# Altium schematic sheet Battery_Interface.SchDoc
size A4; Organization: TESLA Motors, INC; Address1: 3500 Deer Creek Road; Address2: Palo Alto, CA; Address4: U.S.A.; SheetNumber: 2; SheetTotal: 8
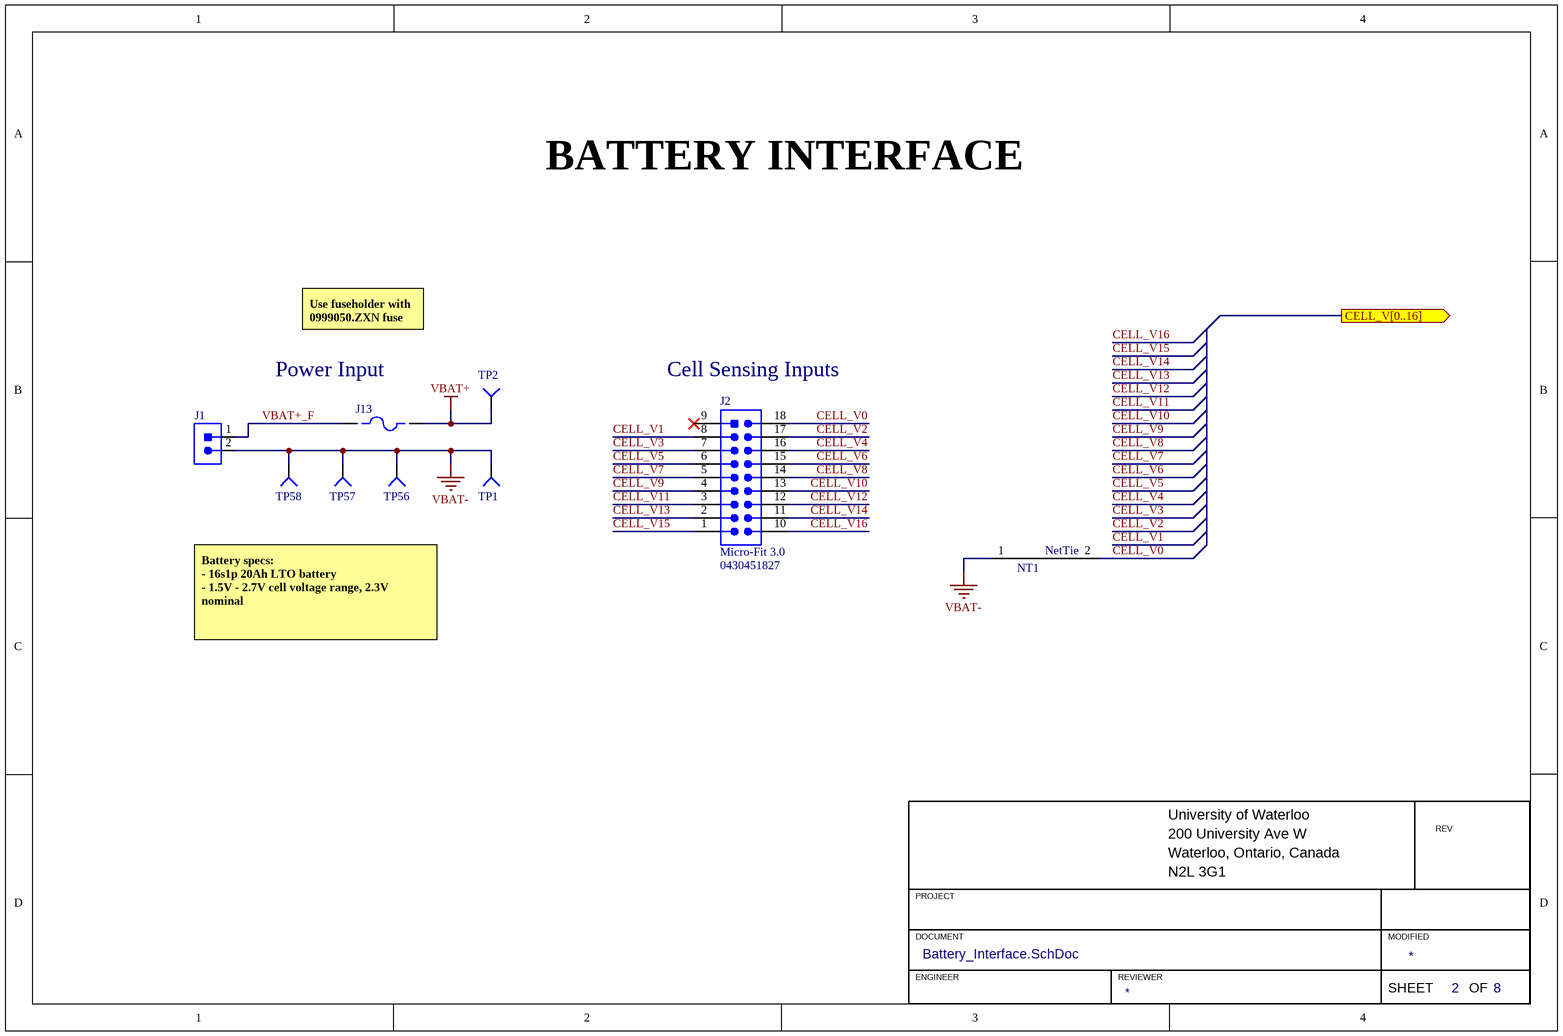
[diagram p0: Battery_Interface.SchDoc]

## Parts
J1  CON_2POS_XT90  [XT90]  (value not drawn)
J2  Family: Micro-Fit 3.0  [MOLEX-0430451827]  (hidden comment: 0430451827)
J13  FUSEHOLDER_MAXI  [3555-2]  (value not drawn)
NT1  NetTie  [NET_TIE]  (value not drawn)
TP1  TESTPOINT_SMD_LOOP  [S1751-46R]  (value not drawn)
TP2  TESTPOINT_SMD_LOOP  [S1751-46R]  (value not drawn)
TP56  TESTPOINT_SMD_LOOP  [S1751-46R]  (value not drawn)
TP57  TESTPOINT_SMD_LOOP  [S1751-46R]  (value not drawn)
TP58  TESTPOINT_SMD_LOOP  [S1751-46R]  (value not drawn)

## Ports
CELL_V[0..16] (out)

## Nets
VBAT+: J13.2 TP2.1(=value)
VBAT-: J1.2 NT1.1 TP1.1(=value) TP56.1(=value) TP57.1(=value) TP58.1(=value)
CELL_V0: J2.18 NT1.2
CELL_V1: J2.8
CELL_V2: J2.17
CELL_V3: J2.7
CELL_V4: J2.16
CELL_V5: J2.6
CELL_V6: J2.15
CELL_V7: J2.5
CELL_V8: J2.14
CELL_V9: J2.4
CELL_V10: J2.13
CELL_V11: J2.3
CELL_V12: J2.12
CELL_V13: J2.2
CELL_V14: J2.11
CELL_V15: J2.1
CELL_V16: J2.10
VBAT+_F: J1.1 J13.1

Not connected (* = marked no-connect by the designer): J2 9*

## Notes on the sheet
- BATTERY INTERFACE
- (near J13) Power Input
- Use fuseholder with 0999050.ZXN fuse
- (near J2) Cell Sensing Inputs
- Battery specs:
  - 16s1p 20Ah LTO battery
  - 1.5V - 2.7V cell voltage range, 2.3V nominal
- University of Waterloo
- 200 University Ave W
- REV
- PROJECT
- Waterloo, Ontario, Canada
- N2L 3G1
- DOCUMENT
- ENGINEER
- REVIEWER
- MODIFIED
- SHEET
- OF

## Library data of the parts
J1 = CON_2POS_XT90: HIGH QUALITY GOLD PLATED XT90 MA; Manufacturer 1: DFRobot; Manufacturer Part Number 1: FIT0588; Mounting Type: TH; Package/Footprint: XT90; Supplier 1: Digi-Key; Supplier Part Number 1: 1738-1438-ND
J2 = CON_MOLEX-HDR_9x2_TH: CONN HEADER VERT 18POS 3MM; Manufacturer 1: Molex; Voltage Rating: 250VAC; Current Rating: 5A; Pitch: 3mm; Supplier 1: Digi-Key; Supplier Part Number 1: WM10723-ND; Manufacturer Part Number 1: 0430451827
J13 = FUSEHOLDER_MAXI: FUSE BLOCK BLADE 500V 50A PCB; Manufacturer 1: Keystone Electronics; Manufacturer Part Number 1: 3555-2; Supplier 1: Digi-Key; Supplier Part Number 1: 36-3555-2-ND; Voltage Rating: 500V; Current Rating: 50A
TP1 TP2 TP56-TP58 = TESTPOINT_SMD_LOOP: TESTPOINT SMD LOOP; Manufacturer 1: Harwin; Supplier 1: Digi-Key; Manufacturer Part Number 1: S1751-46R; Mounting Type: SMD; Package/Footprint: SMD; Supplier Part Number 1: 952-1478-1-ND